# EAGLE design GripperBoard (EAGLE 7.1.0)
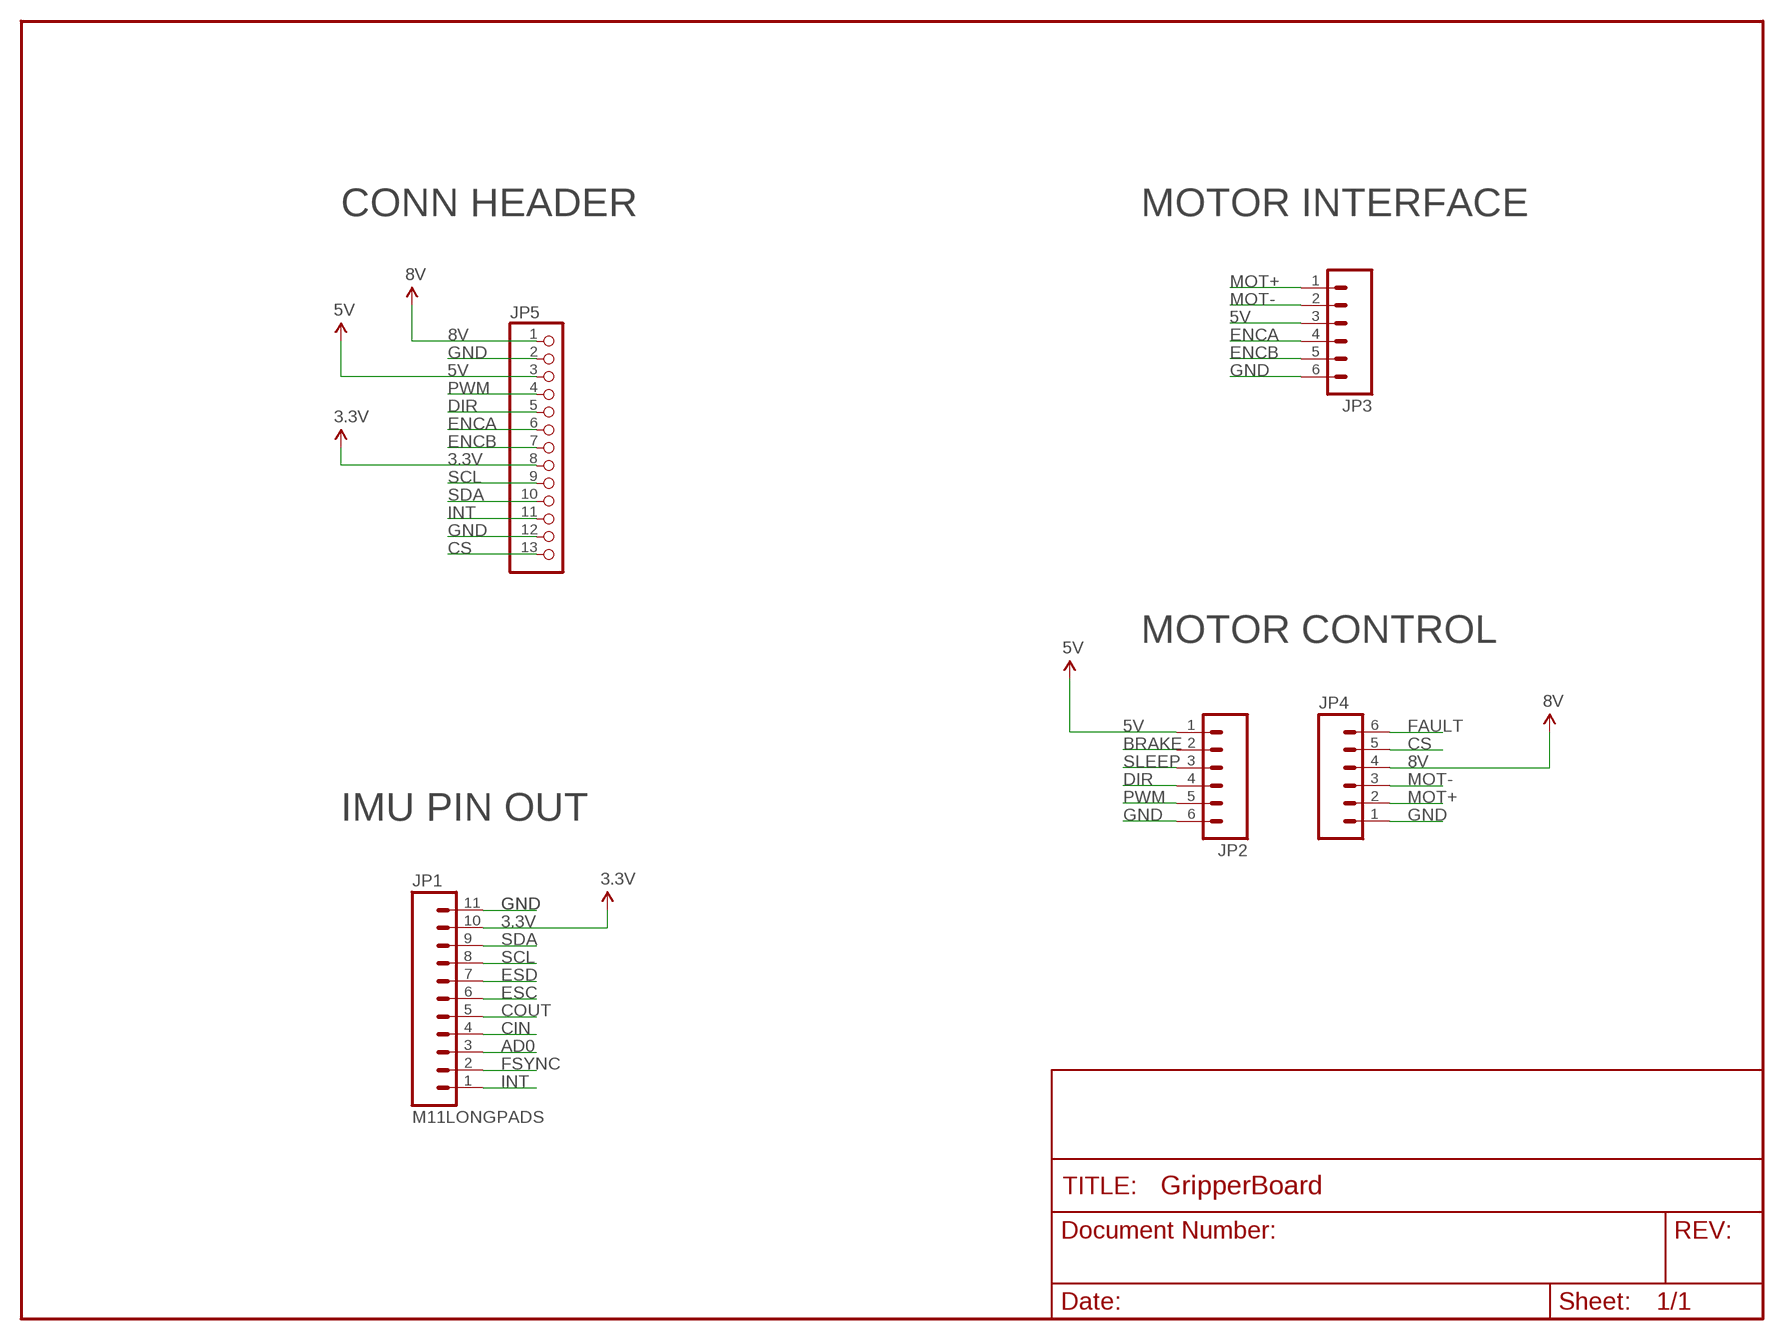
[diagram p0: schematic, sheet 1]

## Parts
JP1  M11LONGPADS  [1X11_LONGPADS]
JP2  M06LONGPADS  [1X06_LONGPADS]
JP3  M06LONGPADS  [1X06_LONGPADS]
JP4  M06LONGPADS  [1X06_LONGPADS]
JP5  PINHD-1X13  [1X13]

## Nets
3.3V: JP1.10 JP5.8
5V: JP2.1 JP3.3 JP5.3
8V: JP4.4 JP5.1
AD0: JP1.3
BRAKE: JP2.2
CIN: JP1.4
COUT: JP1.5
CS: JP4.5 JP5.13
DIR: JP2.4 JP5.5
ENCA: JP3.4 JP5.6
ENCB: JP3.5 JP5.7
ESC: JP1.6
ESD: JP1.7
FAULT: JP4.6
FSYNC: JP1.2
GND: JP1.11 JP2.6 JP3.6 JP4.1 JP5.2 JP5.12
INT: JP1.1 JP5.11
MOT+: JP3.1 JP4.2
MOT-: JP3.2 JP4.3
PWM: JP2.5 JP5.4
SCL: JP1.8 JP5.9
SDA: JP1.9 JP5.10
SLEEP: JP2.3

## Notes on the sheet
- CONN HEADER | MOTOR INTERFACE
- MOTOR CONTROL
- IMU PIN OUT

## Library data of the parts
JP1 = SparkFun:M11: Header 11 Standard 11-pin 0.1" header. Use with straight break away headers (SKU : PRT-00116), right angle break away headers (PRT-00553), swiss pins (PRT-00743), machine pins (PRT-00117), and female headers (PRT-00115).
JP2-JP4 = SparkFun:M06: Header 6 Standard 6-pin 0.1" header. Use with straight break away headers (SKU : PRT-00116), right angle break away headers (PRT-00553), swiss pins (PRT-00743), machine pins (PRT-00117), and female headers (PRT-00115). Molex polarized connector foot print use with SKU : PRT-08094 with associated crimp pins and housings. NOTES ON THE VARIANTS LOCK and LOCK_LONGPADS... This footprint was designed to help hold the alignment of a through-hole component (i.e. 6-pin header) while soldering it into place. You may notice that each hole has been shifted either up or down by 0.005 of an inch from it's more standard position (which is a perfectly straight line). This slight alteration caused the pins (the squares in the middle) to touch the edges of the holes. Because they are alternating, it causes a "brace" to hold the component in place. 0.005 has proven to be the perfect amount of "off-center" position when using our standard breakaway headers. Although looks a little odd when you look at the bare footprint, once you have a header in there, the alteration is very hard to notice. Also, if you push a header all the way into place, it is covered up entirely on the bottom side. This idea of altering the position of holes to aid alignment will be further integrated into the Sparkfun Library for other footprints. It can help hold any component with 3 or more connection pins.
JP5 = adafruit:PINHD-1X13: PIN HEADER

## Net classes
0 default: width 0.305 mm, clearance 0.457 mm

## Board
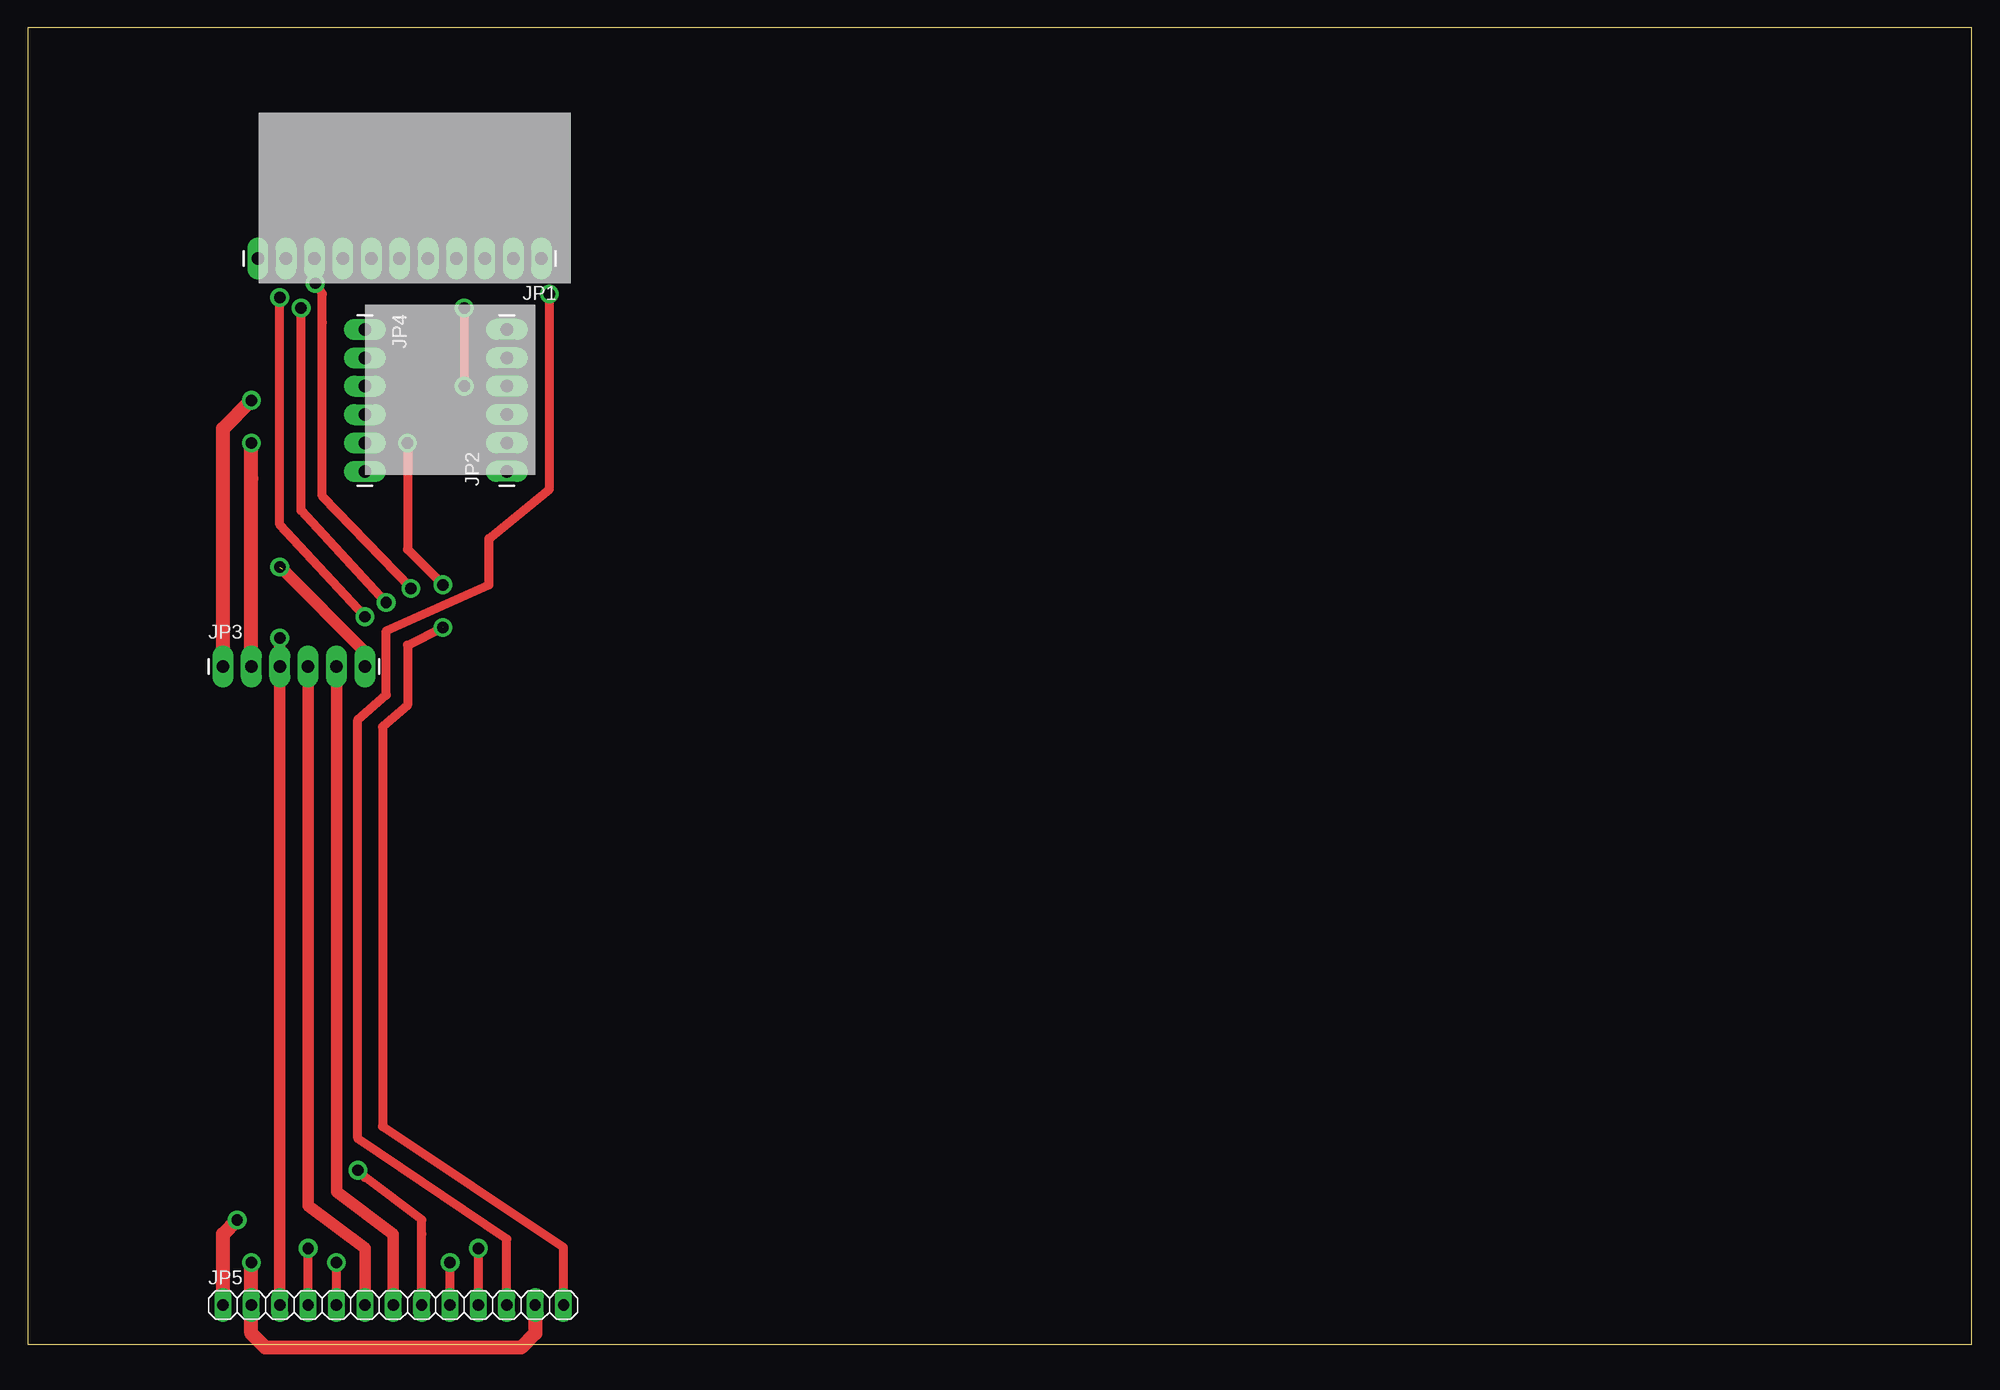
[diagram p1: board, top side]
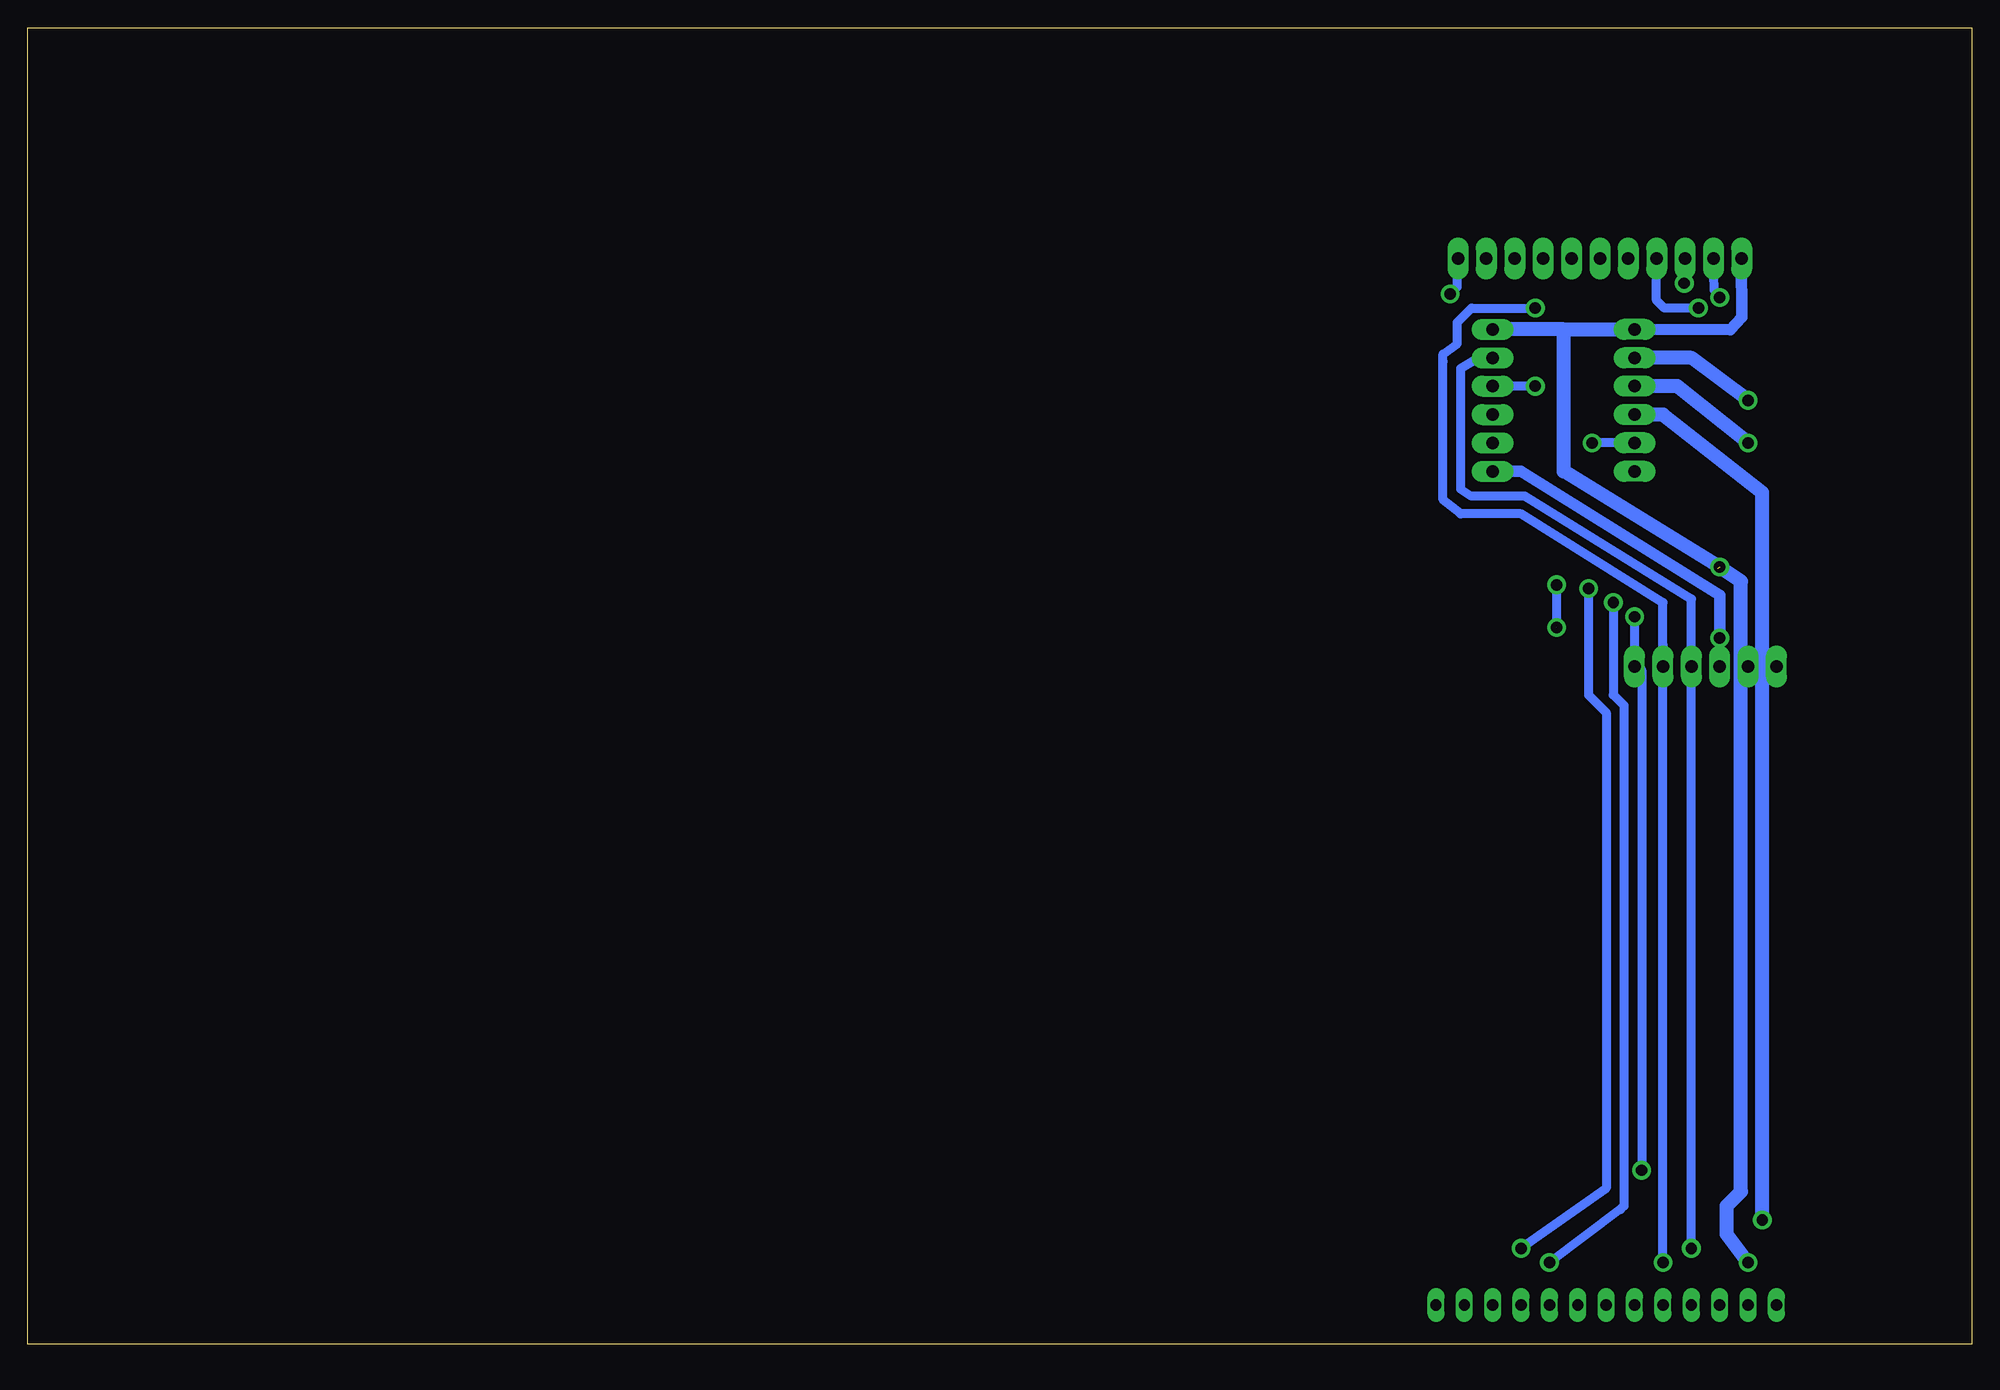
[diagram p2: board, bottom side, seen from below]

Size 173.97 x 117.78 mm. Coordinates in mm from the lower left corner, seen from the top.
Outline: 0,0 173.97,0 173.97,117.78 0,117.78 0,0
Copper layers (1*16): Top 0.035mm / dielectric 1.5mm / Bottom 0.035mm
Design rules "default": minimum track width 10mil, minimum drill 24mil, track to track 8mil, track to pad 8mil, pad to pad 8mil, via to via 8mil, smd to smd 8mil, copper to edge 40mil, drill to drill 8mil, minimum pad ring 10mil, minimum via ring 8mil, stop-mask expansion 4mil, vias tented up to drill 0mil, thermal gap 10mil

### Footprints (pad centres in the part's own frame; a part is rotated, then mirrored left to right if it is on the bottom)
1X11_LONGPADS = drill 1.118 pad 1.88 long: 1 0,0; 2 2.54,0; 3 5.08,0; 4 7.62,0; 5 10.16,0; 6 12.7,0; 7 15.24,0; 8 17.78,0; 9 20.32,0; 10 22.86,0; 11 25.4,0
1X06_LONGPADS = drill 1.118 pad 1.88 long: 1 0,0; 2 2.54,0; 3 5.08,0; 4 7.62,0; 5 10.16,0; 6 12.7,0
1X13 = drill 1.016 long: 1 -15.24,0; 2 -12.7,0; 3 -10.16,0; 4 -7.62,0; 5 -5.08,0; 6 -2.54,0; 7 0,0; 8 2.54,0; 9 5.08,0; 10 7.62,0; 11 10.16,0; 12 12.7,0; 13 15.24,0

### Placement (x,y rotation side)
JP1  45.97,97.16 180 top
JP2  42.86,78.11 90 top
JP3  17.46,60.64 0 top
JP4  30.16,90.81 270 top
JP5  32.7,3.49 0 top

### Tracks (layer width: path | path; a pad name or v marks a point on that pad's centre or on a via)
3.3V  (via drill 1.02 pad 1.68)
  Top 0.813: JP5.8 35.24,9.84 35.24,11.11 30.16,14.92 v29.53,15.56 | v30.16,65.09 22.54,73.34 v22.54,93.66
  Bottom 0.813: v30.16,65.09 30.16,61.28 29.53,60.33 v29.53,15.56 | v22.54,93.66 23.04,94.32 JP1.10
5V  (via drill 1.02 pad 1.68)
  Top 1.016: JP5.3 JP3.3 22.54,62.55 v22.54,63.18
  Bottom 1.016: v22.54,63.18 22.54,66.99 40.32,78.11 JP2.1
8V  (via drill 1.02 pad 1.68)
  Top 1.27: JP5.1 17.46,9.84 v18.73,11.11
  Bottom 1.27: v18.73,11.11 18.73,68.9 18.73,76.2 27.62,83.19 JP4.4
CS  (via drill 1.02 pad 1.68)  (1 unrouted)
  Top 0.813: JP5.13 47.94,8.66 31.75,19.48 31.75,55.24 33.97,57.15 33.97,62.55 37.15,64.14 | v33.97,80.64 33.97,71.12 v37.15,67.94
  Bottom 0.813: JP4.5 v33.97,80.64 | v37.15,67.94 37.15,64.14
DIR  (via drill 1.02 pad 1.68)
  Top 0.813: JP5.5 v27.62,7.3 | v39.05,92.71 v39.05,85.72
  Bottom 0.813: v27.62,7.3 27.62,62.55 27.62,66.36 40.32,74.3 45.72,74.3 47.31,75.56 47.31,87.95 47.31,88.58 46.04,89.53 46.04,91.44 44.77,92.71 v39.05,92.71 | v39.05,85.72 JP2.4
ENCA
  Top 1.016: JP5.6 30.16,8.57 25.08,12.38 JP3.4
ENCB
  Top 1.016: JP5.7 32.7,9.84 27.62,13.65 JP3.5
GND  (via drill 1.02 pad 1.68)  (1 unrouted)
  Top 1.016: JP3.6 30.16,60.01 30.16,61.91 22.74,69.37
  Top 1.27: JP5.12 45.4,2.22 45.4,0.95 44.13,-0.32 21.27,-0.32 20,0.95 JP5.2 v20,7.3
  Bottom 1.016: JP4.1 21.61,90.76 20.58,91.87 20.6,97.08 JP1.11 | 20.64,68.26 22.54,69.53
  Bottom 1.27: 36.51,90.81 36.51,78.11 22.54,69.53 20.64,68.26 20.64,13.65 21.91,12.38 21.91,9.84 v20,7.3 | 36.51,90.81 JP2.6 | 36.51,90.81 JP4.1
INT  (via drill 1.02 pad 1.68)
  Top 0.813: JP5.11 42.86,9.42 29.53,18.41 29.53,55.88 32.07,58.1 32.07,63.82 41.27,67.94 41.27,72.07 46.67,76.52 46.67,92.08 v46.67,93.98
  Bottom 0.813: v46.67,93.98 46.04,94.61 JP1.1
MOT+  (via drill 1.02 pad 1.68)
  Top 1.27: JP3.1 17.46,77.47 17.46,78.74 17.46,80.01 17.46,81.92 v20,84.45
  Bottom 1.27: JP4.2 31.43,88.27 JP4.2 | v20,84.45 25.08,88.27 JP4.2
MOT-  (via drill 1.02 pad 1.68)
  Top 1.27: JP3.2 20,77.47 v20,80.64
  Bottom 1.27: v20,80.64 26.35,85.72 JP4.3
N$8  (via drill 1.02 pad 1.68)
  other vias: 37.15,64.14
N$9  (via drill 1.02 pad 1.68)
  other vias: 22.54,69.53
PWM  (via drill 1.02 pad 1.68)
  Top 0.813: JP5.4 v25.08,8.57
  Bottom 0.813: v25.08,8.57 25.08,61.28 25.08,66.67 40,75.88 44.77,75.88 45.72,76.52 45.72,87.31 44.13,88.27 JP2.5
SCL  (via drill 1.02 pad 1.68)
  Top 0.813: JP5.9 v37.78,7.3 | v32.07,66.36 24.45,74.61 v24.45,92.71
  Bottom 0.813: v37.78,7.3 31.43,12.06 31.11,12.38 31.11,57.15 32.07,58.1 v32.07,66.36 | v24.45,92.71 27.48,92.71 28.2,93.4 JP1.8
SDA  (via drill 1.02 pad 1.68)
  Top 0.813: JP5.10 v40.32,8.57 | v34.29,67.63 26.35,75.88 26.35,91.44 26.35,93.98 v25.72,94.93
  Bottom 0.813: v40.32,8.57 32.7,13.97 32.7,56.52 34.29,58.1 v34.29,67.63 | v25.72,94.93 JP1.9